# EAGLE design IoTKitV3th (EAGLE 9.2.0)
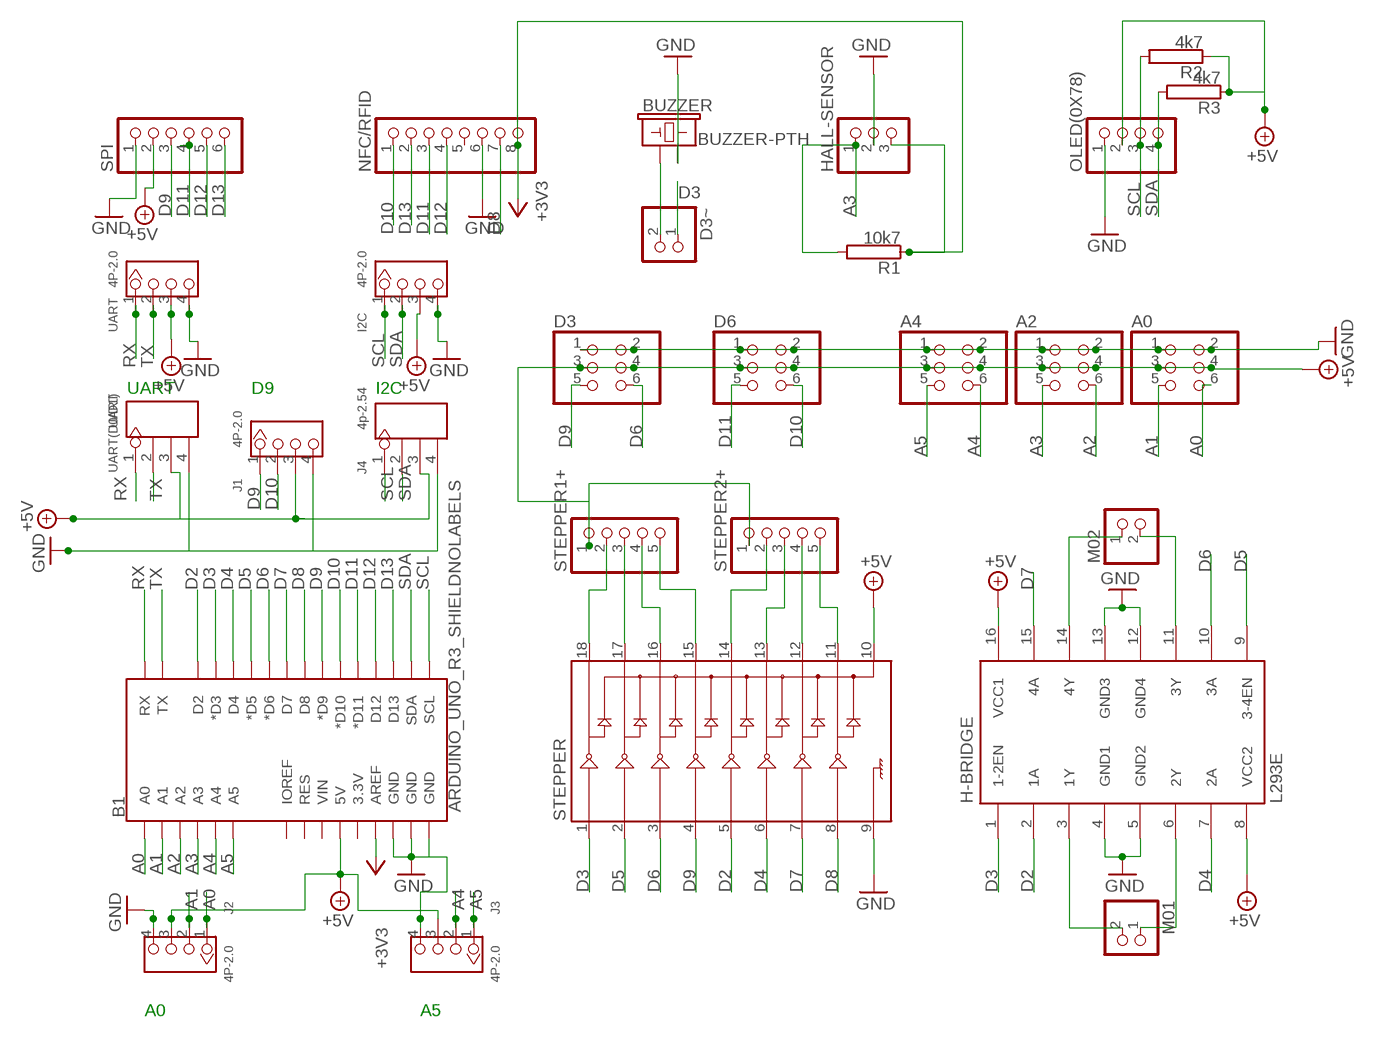
[diagram p0: schematic, sheet 1]

## Parts
A0  PINHD-2X3  [2X03]
A2  PINHD-2X3  [2X03]
A4  PINHD-2X3  [2X03]
B1  ARDUINO_UNO_R3_SHIELDNOLABELS  [UNO_R3_SHIELD_NOLABELS]
BUZZER  BUZZER-PTH  [BUZZER-12MM]
D3  PINHD-2X3  [2X03]
D3~  PINHD-1X2  [1X02]
D6  PINHD-2X3  [2X03]
H-BRIDGE  L293E  [DIL16]
HALL-SENSOR  PINHD-1X3  [1X03]
I2C  4P-2.0  GROVE-CONNECTOR-DIP(4P-2.0)  [HW4-2.0]
J1  4P-2.0  GROVE-CONNECTOR-DIP(4P-2.0)  [HW4-2.0]
J2  4P-2.0  GROVE-CONNECTOR-DIP(4P-2.0)  [HW4-2.0]
J3  4P-2.0  GROVE-CONNECTOR-DIP(4P-2.0)  [HW4-2.0]
J4  4p-2.54  DIP-BLACK-MALE-HEADER-VERT(4P-2.54)  [H4-2.54]
M01  PINHD-1X2  [1X02]
M02  PINHD-1X2  [1X02]
NFC/RFID  PINHD-1X8  [1X08]
OLED(0X78)  PINHD-1X4  [1X04]
R1  10k7  RCA0001  [CA0001]
R2  4k7  RCA0001  [CA0001]
R3  4k7  RCA0001  [CA0001]
SPI  PINHD-1X6  [1X06]
STEPPER  ULN2803DIP  [DIL18]
STEPPER1+  PINHD-1X5  [1X05]
STEPPER2+  PINHD-1X5  [1X05]
UART  4P-2.0  GROVE-CONNECTOR-DIP(4P-2.0)  [HW4-2.0]
UART(D0/D1)  UART  DIP-BLACK-MALE-HEADER-VERT(4P-2.54)  [H4-2.54]

## Nets
+3V3: B1.AREF HALL-SENSOR.3 NFC/RFID.8 R1.1
+5V: A0.3 A0.4 A2.3 A2.4 A4.3 A4.4 B1.5V D3.3 D3.4 D6.3 D6.4 H-BRIDGE.8(VCC2) H-BRIDGE.16(VCC1) I2C.3 J1.3 J2.3 J3.3 J4.3 OLED(0X78).2 R2.1 R3.1 SPI.2 STEPPER1+.1 STEPPER2+.1 STEPPER.10 UART(D0/D1).3 UART.3
A0: A0.6 B1.A0 J2.1
A1: A0.5 B1.A1 J2.2
A2: A2.6 B1.A2
A3: A2.5 B1.A3 HALL-SENSOR.1 R1.2
A4: A4.6 B1.A4 J3.2
A5: A4.5 B1.A5 J3.1
D2: B1.D2 H-BRIDGE.2(1A) STEPPER.5
D3: B1.D3(*D3) D3~.1 H-BRIDGE.1(1-2EN) STEPPER.1
D4: B1.D4 H-BRIDGE.7(2A) STEPPER.6
D5: B1.D5(*D5) H-BRIDGE.9(3-4EN) STEPPER.2
D6: B1.D6(*D6) D3.6 H-BRIDGE.10(3A) STEPPER.3
D7: B1.D7 H-BRIDGE.15(4A) STEPPER.7
D8: B1.D8 NFC/RFID.7 STEPPER.8
D9: B1.D9(*D9) D3.5 J1.1 SPI.3 STEPPER.4
D10: B1.D10(*D10) D6.6 J1.2 NFC/RFID.1
D11: B1.D11(*D11) D6.5 NFC/RFID.3 SPI.4
D12: B1.D12 NFC/RFID.4 SPI.5
D13: B1.D13 NFC/RFID.2 SPI.6
GND: A0.1 A0.2 A2.1 A2.2 A4.1 A4.2 B1.GND@0(GND) B1.GND@1(GND) B1.GND@2(GND) BUZZER.- D3.1 D3.2 D6.1 D6.2 H-BRIDGE.4(GND1) H-BRIDGE.5(GND2) H-BRIDGE.12(GND4) H-BRIDGE.13(GND3) HALL-SENSOR.2 I2C.4 J1.4 J2.4 J3.4 J4.4 NFC/RFID.6 OLED(0X78).1 SPI.1 STEPPER.9 UART(D0/D1).4 UART.4
M01: H-BRIDGE.6(2Y) M01.1
N$1: STEPPER2+.2 STEPPER.14
N$2: STEPPER2+.3 STEPPER.13
N$3: STEPPER2+.4 STEPPER.12
N$4: STEPPER2+.5 STEPPER.11
N$5: BUZZER.+ D3~.2
N$30: STEPPER1+.2 STEPPER.18
N$31: STEPPER1+.3 STEPPER.17
N$32: STEPPER1+.4 STEPPER.16
N$33: STEPPER1+.5 STEPPER.15
N$38: H-BRIDGE.14(4Y) M02.1
N$39: H-BRIDGE.11(3Y) M02.2
N$40: H-BRIDGE.3(1Y) M01.2
RX: B1.RX UART(D0/D1).1 UART.1
SCL: B1.SCL I2C.1 J4.1 OLED(0X78).3 R2.2
SDA: B1.SDA I2C.2 J4.2 OLED(0X78).4 R3.2
TX: B1.TX UART(D0/D1).2 UART.2
Unconnected: B1.3.3V B1.IOREF B1.RES B1.VIN NFC/RFID.5

## Notes on the sheet
- UART | D9 | I2C
- A0 | A5

## Library data of the parts
A0 A2 A4 D3 D6 = pinhead:PINHD-2X3: PIN HEADER
B1 = SparkFun-Boards:ARDUINO_UNO_R3_SHIELD: Arduino R3 Shield Footprint Shield form compatible with the Arduino Uno R3. SparkFun Products: MG2639 Cellular Shield <https://www.sparkfun.com/products/13120> MIDI Shield <https://www.sparkfun.com/products/12898> R3 Stackable Headers Kit <https://www.sparkfun.com/products/11417>
BUZZER = SparkFun-Electromechanical:BUZZER: Buzzer Small round buzzers that operate around the audible 2kHz range. You can use these as speakers to create simple music or user interfaces. Variant Overview: PTH - Mini Speaker - PC Mount 12mm 2.048kHz <https://www.sparkfun.com/products/7950> PTH_KIT - Mini Speaker - PC Mount 12mm 2.048kHz <https://www.sparkfun.com/products/7950> KIT simplifies soldering by adding stop mask to one side of the pads. PTH_NO_SILK - Mini Speaker - PC Mount 12mm 2.048kHz <https://www.sparkfun.com/products/7950> No silkscreen indicator of buzzer outline. PTH_KIT_NO_SILK - Mini Speaker - PC Mount 12mm 2.048kHz <https://www.sparkfun.com/products/7950> KIT package w/o silkscreen SMD - Buzzer Audio Magnetic (CCV-084B16) SMD buzzer used on, e.g. the LilyPad Buzzer <https://www.sparkfun.com/products/8463> and RFID USB Reader <https://www.sparkfun.com/products/9963>. SMD_KIT - Buzzer Audio Magnetic (CCV-084B16) SMD Buzzer with elongated pins to make soldering easier. Used on the SparkFun Simon Says - Surface Mount Soldering Kit <https://www.sparkfun.com/products/10935>.; PROD_ID: COMP-08253; SF_SKU: COM-07950
D3~ M01 M02 = pinhead:PINHD-1X2: PIN HEADER
H-BRIDGE = texas:L293E: TI DEVICE; MF: Arrow Electronics; MPN: L293E; OC_FARNELL: 1467711; OC_NEWARK: 89K0732
HALL-SENSOR = pinhead:PINHD-1X3: PIN HEADER
I2C J1-J3 UART = Seeed-Connector:GROVE-CONNECTOR-DIP(4P-2.0): 320110033
J4 = Seeed-Connector:DIP-BLACK-MALE-HEADER-VERT(4P-2.54): 320020017; MPN: P125-1104A0BS116A1
NFC/RFID = pinhead:PINHD-1X8: PIN HEADER
OLED(0X78) = pinhead:PINHD-1X4: PIN HEADER
R1-R3 = resistor-power:R: Power Resitor; OC_FARNELL: unknown; OC_NEWARK: unknown
SPI = pinhead:PINHD-1X6: PIN HEADER
STEPPER = SparkFun-IC-Special-Function:ULN2803: Darlington Driver(IC-07959, low stock) ULN2803 Darlington array. 500mA max per channel, 8-channel package. Spark Fun Electronics SKU : COM-00312
STEPPER1+ STEPPER2+ = pinhead:PINHD-1X5: PIN HEADER
UART(D0/D1) = Seeed-Connector:DIP-BLACK-MALE-HEADER-VERT(4P-2.54): 320020017; MPN: P125-1104A0BS116A1; VALUE: 4p-2.54

## Board
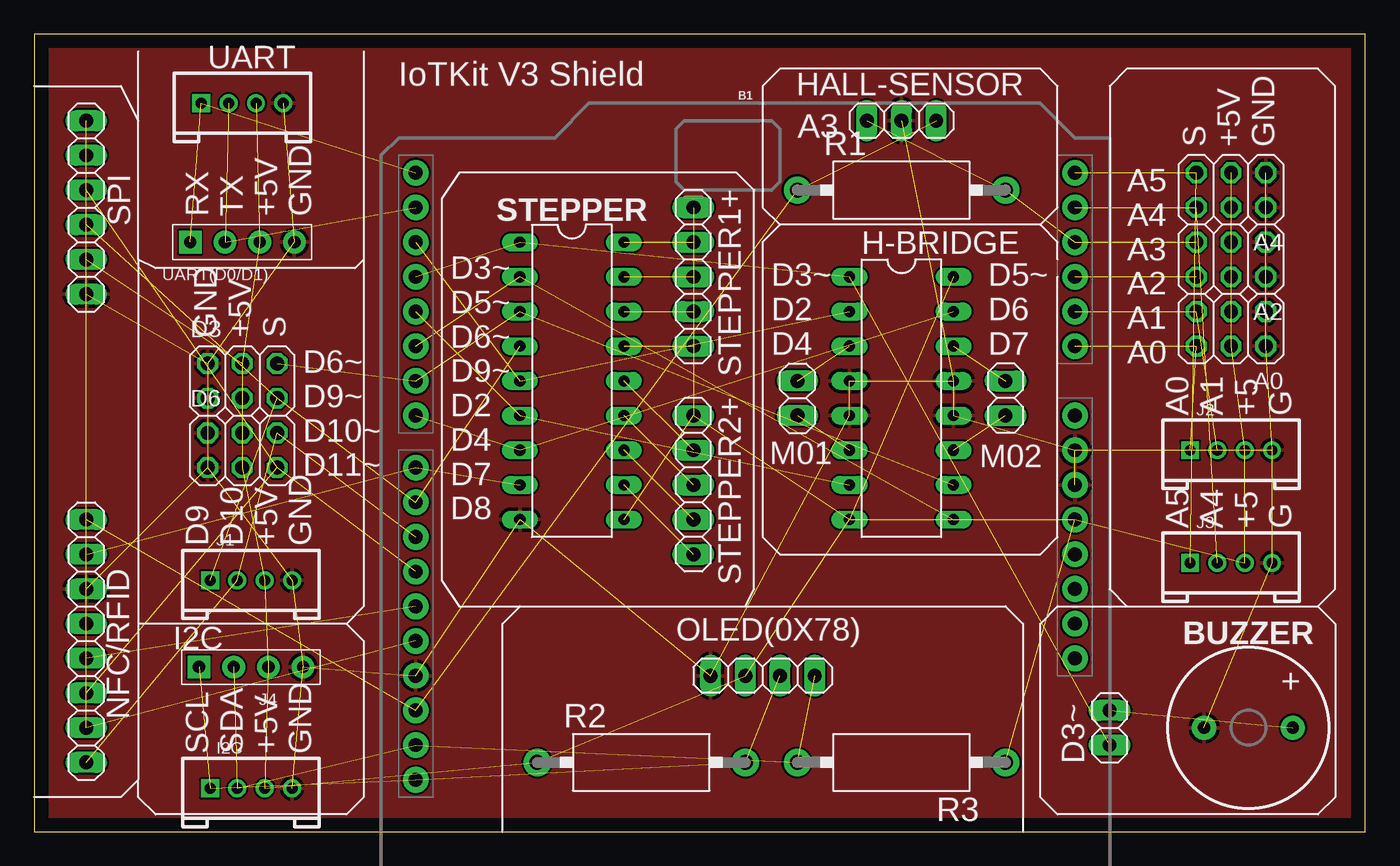
[diagram p1: board, top side]
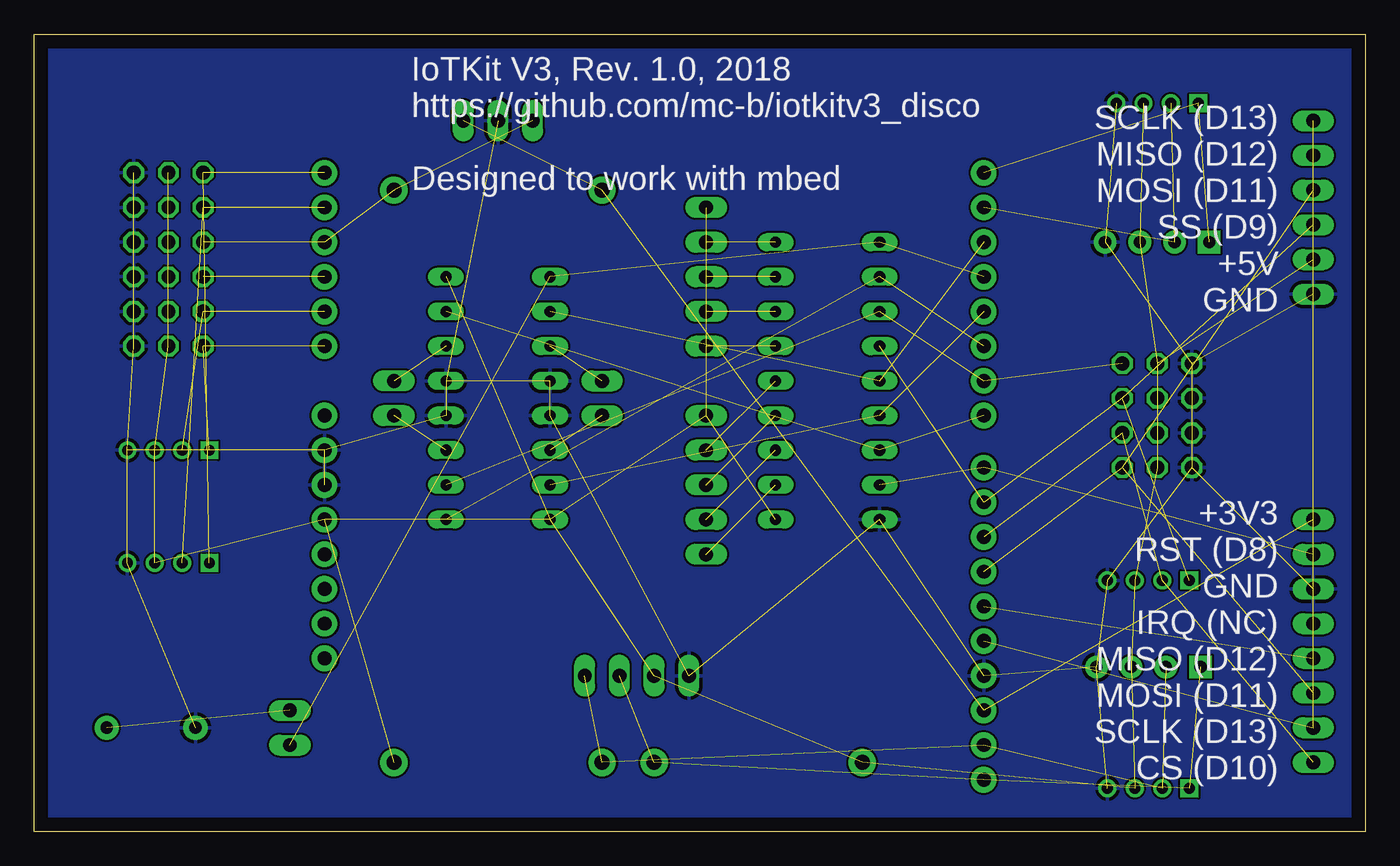
[diagram p2: board, bottom side, seen from below]

Size 97.46 x 58.41 mm. Coordinates in mm from the lower left corner, seen from the top.
Outline: 0,0 97.46,0 97.46,58.41 0,58.41 0,0
Copper layers (1*16): Top 0.035mm / dielectric 1.5mm / Bottom 0.035mm
Design rules "default": minimum track width 6mil, minimum drill 0.35mm, track to track 6mil, track to pad 6mil, pad to pad 6mil, via to via 6mil, smd to smd 6mil, copper to edge 40mil, drill to drill 6mil, minimum pad ring 10mil, minimum via ring 8mil, stop-mask expansion 4mil, vias tented up to drill 0mil, thermal gap 10mil

### Footprints (pad centres in the part's own frame; a part is rotated, then mirrored left to right if it is on the bottom)
2X03 = drill 1.016 octagon: 1 -2.54,-1.27; 2 -2.54,1.27; 3 0,-1.27; 4 0,1.27; 5 2.54,-1.27; 6 2.54,1.27
UNO_R3_SHIELD_NOLABELS = drill 1.016 pad 1.88: 3.3V 24.13,-3.81; 5V 24.13,-1.27; A0 24.13,11.43; A1 24.13,13.97; A2 24.13,16.51; A3 24.13,19.05; A4 24.13,21.59; A5 24.13,24.13; AREF -24.13,-15.24; D2 -24.13,19.05; D3 -24.13,16.51; D4 -24.13,13.97; D5 -24.13,11.43; D6 -24.13,8.89; D7 -24.13,6.35; D8 -24.13,2.54; D9 -24.13,0; D10 -24.13,-2.54; D11 -24.13,-5.08; D12 -24.13,-7.62; D13 -24.13,-10.16; GND@0 24.13,1.27; GND@1 24.13,3.81; GND@2 -24.13,-12.7; IOREF 24.13,-8.89; NC 24.13,-11.43; RES 24.13,-6.35; RX -24.13,24.13; SCL -24.13,-20.32; SDA -24.13,-17.78; TX -24.13,21.59; VIN 24.13,6.35
BUZZER-12MM = drill 0.9 pad 1.778: + 3.25,0; - -3.25,0
1X02 = drill 1.016 long: 1 -1.27,0; 2 1.27,0
DIL16 = drill 0.813 long: 1 -8.89,-3.81; 2 -6.35,-3.81; 3 -3.81,-3.81; 4 -1.27,-3.81; 5 1.27,-3.81; 6 3.81,-3.81; 7 6.35,-3.81; 8 8.89,-3.81; 9 8.89,3.81; 10 6.35,3.81; 11 3.81,3.81; 12 1.27,3.81; 13 -1.27,3.81; 14 -3.81,3.81; 15 -6.35,3.81; 16 -8.89,3.81
1X03 = drill 1.016 long: 1 -2.54,0; 2 0,0; 3 2.54,0
HW4-2.0 = drill 0.8 pad 1.27 square: 1 -3,0 | drill 0.8 pad 1.27: 2 -1,0; 3 1,0; 4 3,0
H4-2.54 = drill 0.889 pad 1.651 square: 1 0,3.81 | drill 0.889 pad 1.651: 2 0,1.27; 3 0,-1.27; 4 0,-3.81
1X08 = drill 1.016 long: 1 -8.89,0; 2 -6.35,0; 3 -3.81,0; 4 -1.27,0; 5 1.27,0; 6 3.81,0; 7 6.35,0; 8 8.89,0
1X04 = drill 1.016 long: 1 -3.81,0; 2 -1.27,0; 3 1.27,0; 4 3.81,0
CA0001 = drill 1.1 pad 2: 1 -7.62,0; 2 7.62,0
1X06 = drill 1.016 long: 1 -6.35,0; 2 -3.81,0; 3 -1.27,0; 4 1.27,0; 5 3.81,0; 6 6.35,0
DIL18 = drill 0.813 long: 1 -10.16,-3.81; 2 -7.62,-3.81; 3 -5.08,-3.81; 4 -2.54,-3.81; 5 0,-3.81; 6 2.54,-3.81; 7 5.08,-3.81; 8 7.62,-3.81; 9 10.16,-3.81; 10 10.16,3.81; 11 7.62,3.81; 12 5.08,3.81; 13 2.54,3.81; 14 0,3.81; 15 -2.54,3.81; 16 -5.08,3.81; 17 -7.62,3.81; 18 -10.16,3.81
1X05 = drill 1.016 long: 1 -5.08,0; 2 -2.54,0; 3 0,0; 4 2.54,0; 5 5.08,0

### Placement (x,y rotation side)
A0  87.63,36.83 180 top
A2  87.63,41.91 180 top
A4  87.63,46.99 180 top
B1  52.07,24.13 0 top
BUZZER  88.9,7.62 0 top
D3  15.24,33.02 0 top
D3~  78.74,7.62 90 top
D6  15.24,27.94 0 top
H-BRIDGE  63.5,31.75 270 top
HALL-SENSOR  63.5,52.07 0 top
I2C  15.88,3.17 0 top
J1  15.88,18.41 0 top
J2  87.63,27.94 0 top
J3  87.63,19.68 0 top
J4  15.88,12.06 90 top
M01  55.88,31.75 90 top
M02  71.12,31.75 270 top
NFC/RFID  3.81,13.97 90 top
OLED(0X78)  53.34,11.43 0 top
R1  63.5,46.99 0 top
R2  44.45,5.08 0 top
R3  63.5,5.08 180 top
SPI  3.81,45.72 90 top
STEPPER  39.37,33.02 270 top
STEPPER1+  48.26,40.64 270 top
STEPPER2+  48.26,25.4 270 top
UART  15.24,53.34 0 top
UART(D0/D1)  15.24,43.18 90 top

### Tracks (layer width: path | path; a pad name or v marks a point on that pad's centre or on a via)
+3V3  (3 unrouted)
+5V  (26 unrouted)
A0  (2 unrouted)
A1  (2 unrouted)
A2  (1 unrouted)
A3  (3 unrouted)
A4  (2 unrouted)
A5  (2 unrouted)
D2  (2 unrouted)
D3  (3 unrouted)
D4  (2 unrouted)
D5  (2 unrouted)
D6  (3 unrouted)
D7  (2 unrouted)
D8  (2 unrouted)
D9  (4 unrouted)
D10  (3 unrouted)
D11  (3 unrouted)
D12  (2 unrouted)
D13  (2 unrouted)
GND  (29 unrouted)
  pour Top: 0,58.42 0,0 97.79,0 97.79,58.42
  pour Bottom: 0,58.42 0,0 97.79,0 97.79,58.42
M01  (1 unrouted)
N$1  (1 unrouted)
N$2  (1 unrouted)
N$3  (1 unrouted)
N$4  (1 unrouted)
N$5  (1 unrouted)
N$30  (1 unrouted)
N$31  (1 unrouted)
N$32  (1 unrouted)
N$33  (1 unrouted)
N$38  (1 unrouted)
N$39  (1 unrouted)
N$40  (1 unrouted)
RX  (2 unrouted)
SCL  (4 unrouted)
SDA  (4 unrouted)
TX  (2 unrouted)

### Text on the board
tNames: IoTKit V3 Shield | A3 | S / +5V / GND | RX / TX / +5V / GND | GND / +5V / S | D3~ / D2 / D4 | D5~ / D6 / D7 | A5 / A4 / A3 / A2 / A1 / A0 | A0 / A1 / +5 / G | D6~ / D9~ / D10~ / D11~ | D3~ / D5~ / D6~ / D9~ / D2 / D4 / D7 / D8 | A5 / A4 / +5 / G | D9 / D10 / +5V / GND | I2C | + | SCL / SDA / +5V / GND
bNames: IoTKit V3, Rev. 1.0, 2018 / https://github.com/mc-b/iotkitv3_disco / / Designed to work with mbed | SCLK (D13) / MISO (D12) / MOSI (D11) / SS (D9) / +5V / GND | +3V3 / RST (D8) / GND / IRQ (NC) / MISO (D12) / MOSI (D11) / SCLK (D13) / CS (D10)